# EAGLE schematic prototypeV2.1 (EAGLE 9.4.2)
DESIGNER: Juan J. Rojas; INSTITUTION: Kyushu Institute of Technology; PROJECT_NAME: BDC_Prototype; VERSION: 1.1
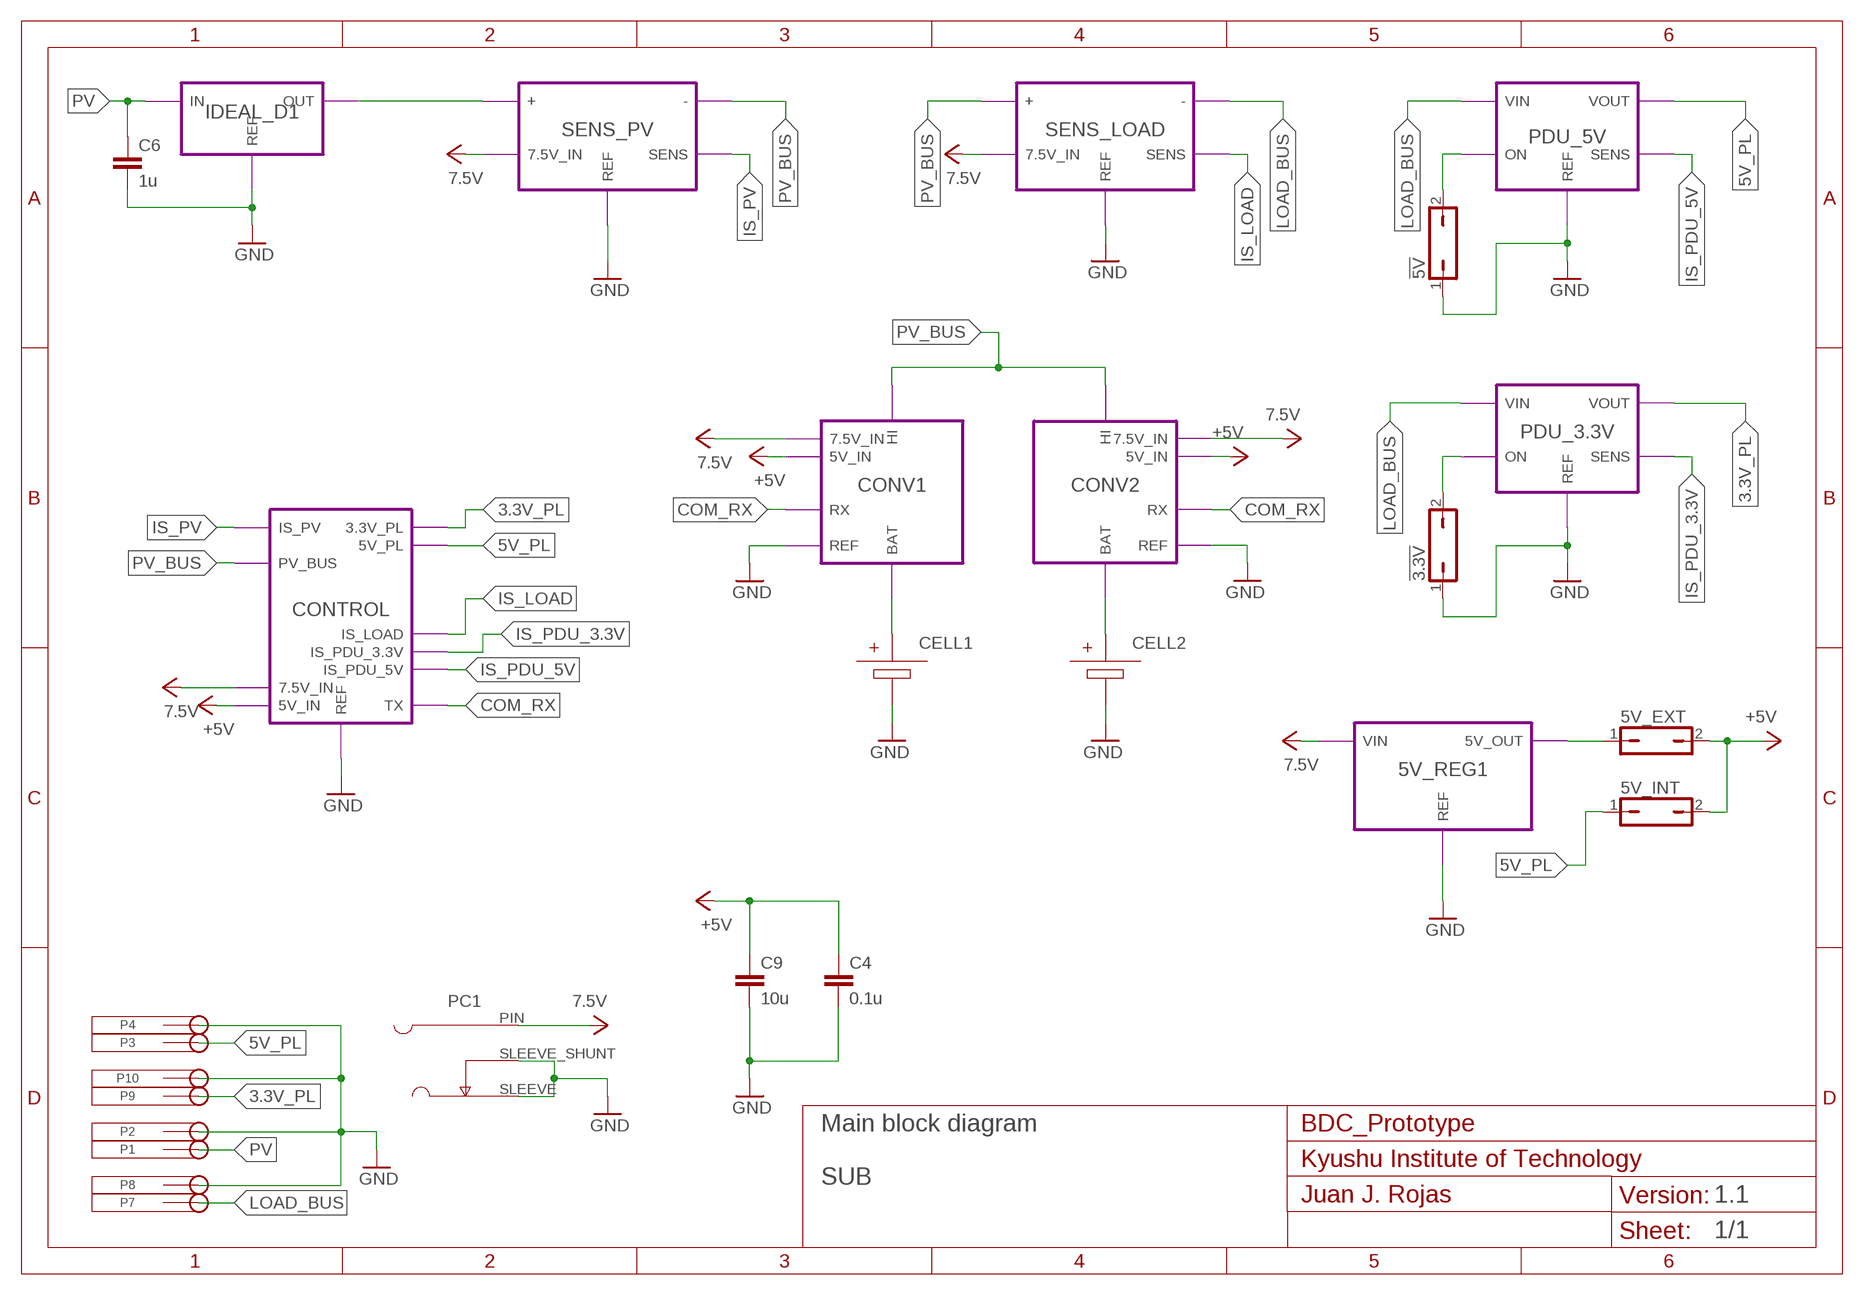
[diagram p0: schematic, sheet 1]
FRAME1 (A4L-JUANJO): SUBTITLE: SUB; TITLE: Main block diagram

## Parts
5V_EXT  J2PSINGLE  [J2P]
5V_INT  J2PSINGLE  [J2P]
!3.3V  J2PSINGLE  [J2P]
!5V  J2PSINGLE  [J2P]
C4  0.1u  NONPOL_CAP-0603  [C0603]
C6  1u  NONPOL_CAP-0603  [C0603]
C9  10u  NONPOL_CAP-0603  [C0603]
CELL1  CELL18650_HOLDER  [18650_HOLDER]
CELL2  CELL18650_HOLDER  [18650_HOLDER]
P1  TJ-563  [TJ-563]
P2  TJ-563  [TJ-563]
P3  TJ-563  [TJ-563]
P4  TJ-563  [TJ-563]
P7  TJ-563  [TJ-563]
P8  TJ-563  [TJ-563]
P9  TJ-563  [TJ-563]
P10  TJ-563  [TJ-563]
PC1  722RA  [722RA]

## Module instances
CONV1 = BIDIRECTIONAL_CONVERTER (part numbers offset by 100)
CONV2 = BIDIRECTIONAL_CONVERTER (part numbers offset by 200)
SENS_PV = BI_CURR_MEAS (part numbers offset by 500)
SENS_LOAD = BI_CURR_MEAS (part numbers offset by 600)
5V_REG1 = 5V_REGULATOR (part numbers offset by 800)
PDU_5V = POWER_DISTRIBUTION_UNIT_5V (part numbers offset by 900)
IDEAL_D1 = IDEAL_DIODE (part numbers offset by 1100)
PDU_3.3V = POWER_DISTRIBUTION_UNIT_3.3V (part numbers offset by 1200)
CONTROL = CONTROLLER (part numbers offset by 300)

## Nets
3.3V_PL: P9.P(PIN) ; port PDU_3.3V.VOUT CONTROL.3.3V_PL
5V_ON: !5V.2 ; port PDU_5V.ON
5V_PL: 5V_INT.1 P3.P(PIN) ; port PDU_5V.VOUT CONTROL.5V_PL
7.5V: PC1.PIN ; port SENS_PV.7.5V_IN SENS_LOAD.7.5V_IN 5V_REG1.VIN CONV1.7.5V_IN CONV2.7.5V_IN CONTROL.7.5V_IN
12V_ON: !3.3V.2 ; port PDU_3.3V.ON
+5V: 5V_EXT.2 5V_INT.2 C4.1 C9.1 ; port CONV1.5V_IN CONV2.5V_IN CONTROL.5V_IN
COM_RX: port CONV1.RX CONV2.RX CONTROL.TX
GND: !3.3V.1 !5V.1 C4.2 C6.2 C9.2 CELL1.BB1.N(-) CELL2.BB1.N(-) P2.P(PIN) P4.P(PIN) P8.P(PIN) P10.P(PIN) PC1.SLEEVE PC1.SLEEVE_SHUNT ; port CONV1.REF CONV2.REF SENS_PV.REF SENS_LOAD.REF PDU_5V.REF IDEAL_D1.REF PDU_3.3V.REF 5V_REG1.REF CONTROL.REF
IS_LOAD: port SENS_LOAD.SENS CONTROL.IS_LOAD
IS_PDU_3.3V: port CONTROL.IS_PDU_3.3V PDU_3.3V.SENS
IS_PDU_5V: port CONTROL.IS_PDU_5V PDU_5V.SENS
IS_PV: port SENS_PV.SENS CONTROL.IS_PV
LOAD_BUS: P7.P(PIN) ; port SENS_LOAD.- PDU_5V.VIN PDU_3.3V.VIN
N$1: CELL1.BB1.P(+) ; port CONV1.BAT
N$4: CELL2.BB1.P(+) ; port CONV2.BAT
N$5: 5V_EXT.1 ; port 5V_REG1.5V_OUT
N$6: port SENS_PV.+ IDEAL_D1.OUT
PV: C6.1 P1.P(PIN) ; port IDEAL_D1.IN
PV_BUS: port SENS_PV.- CONV1.HI CONV2.HI SENS_LOAD.+ CONTROL.PV_BUS

## Library data of the parts
5V_EXT 5V_INT !3.3V !5V = Interfaces:J2P: JUMPER
C4 C6 C9 = Pasives:NONPOL_CAP
CELL1 CELL2 = Sources:CELL
P1-P4 P7-P10 = Interfaces:TJ-563
PC1 = Interfaces:722RA

## Module BIDIRECTIONAL_CONVERTER
Ports: REF(pwr) HI(io) 7.5V_IN(pwr) 5V_IN(pwr) RX(io) BAT(io)
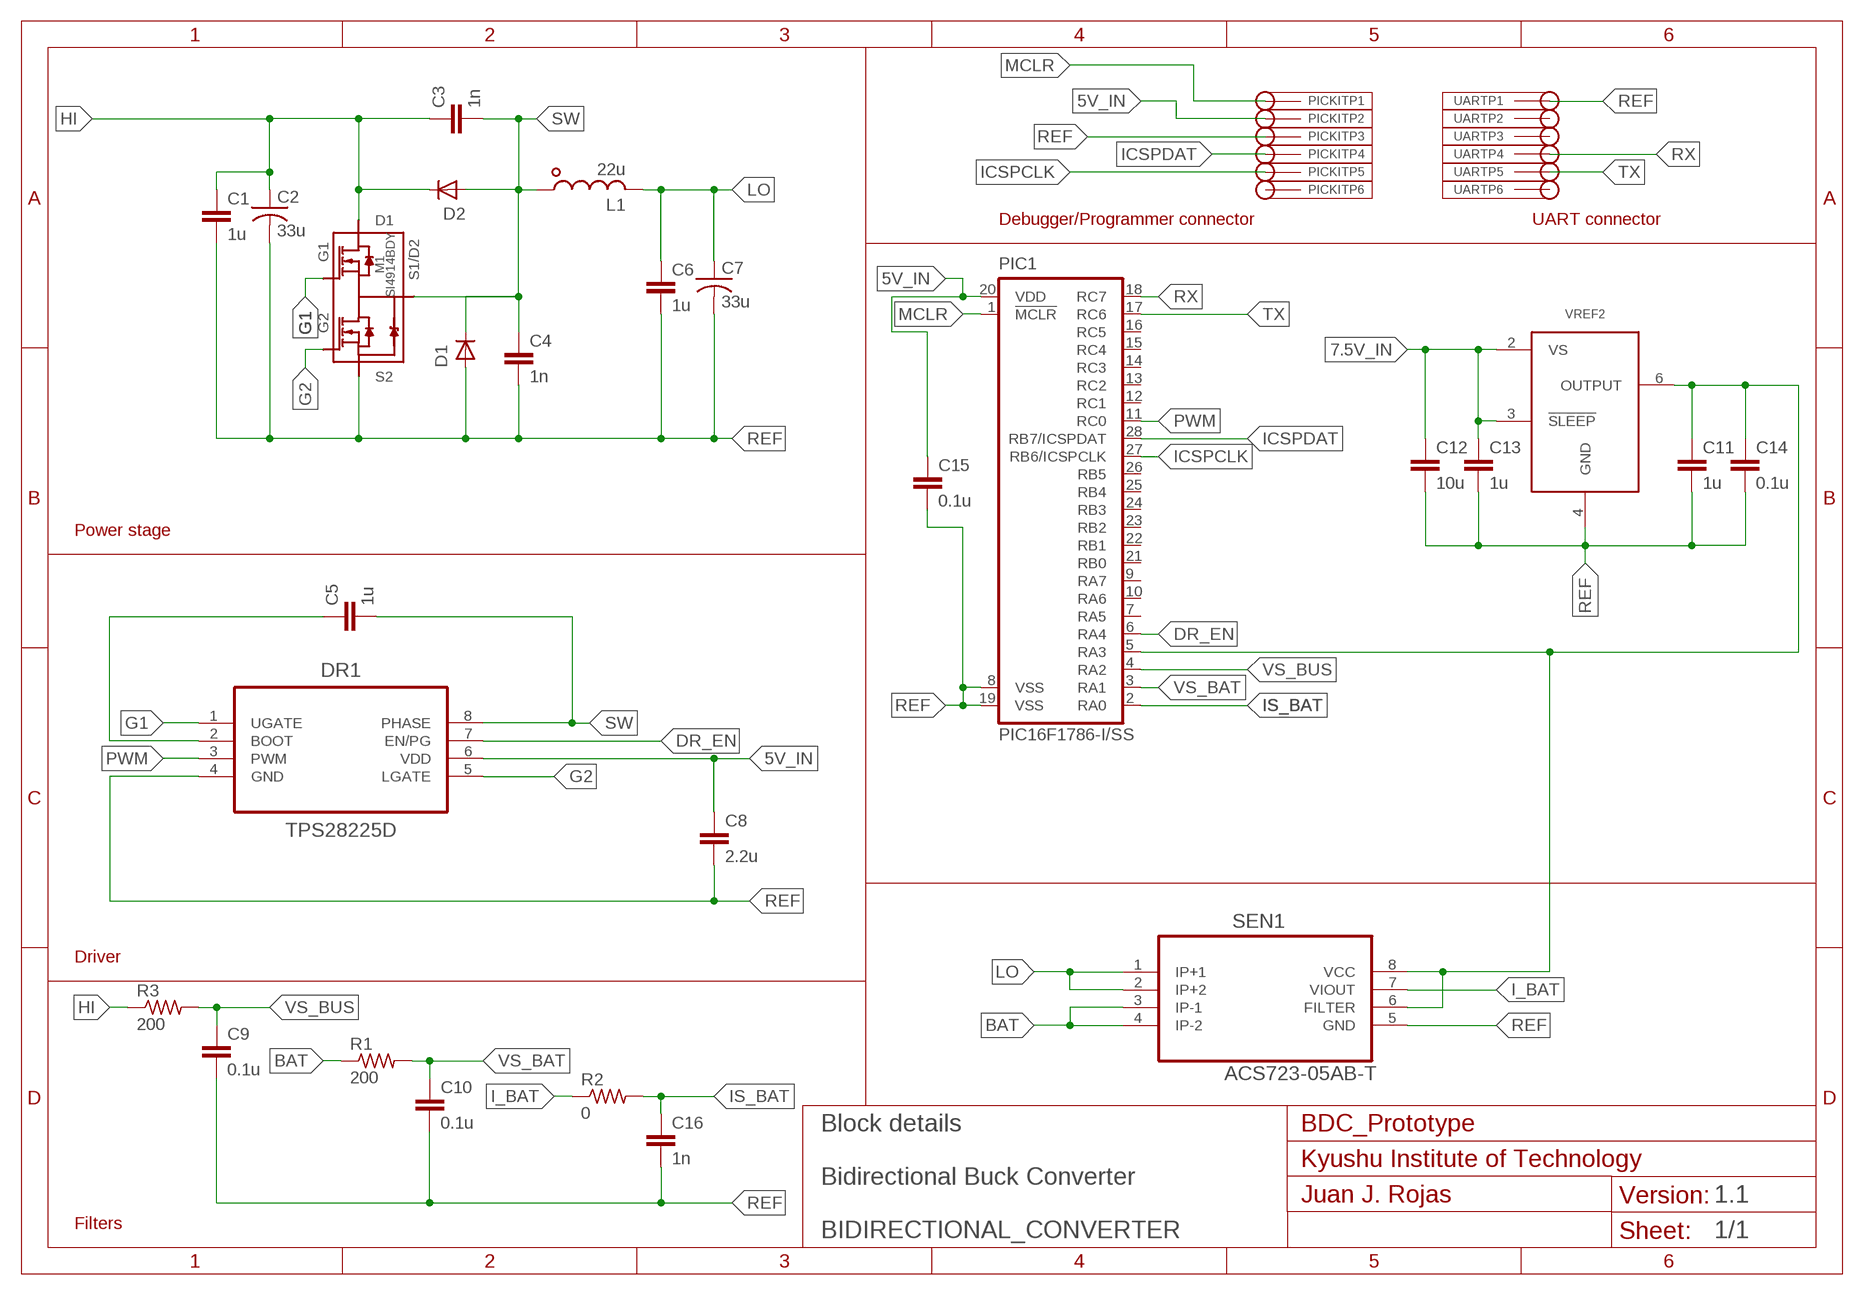
[diagram p1: schematic, module BIDIRECTIONAL_CONVERTER, sheet 1]
FRAME1 (A4L-JUANJO): SUBTITLE: Bidirectional Buck Converter; TITLE: Block details

### Parts
C1  1u  NONPOL_CAP-0603  [C0603]
C2  33u  POL_CAP-7343  [C7343]
C3  1n  NONPOL_CAP-0603  [C0603]
C4  1n  NONPOL_CAP-0603  [C0603]
C5  1u  NONPOL_CAP-0603  [C0603]
C6  1u  NONPOL_CAP-0603  [C0603]
C7  33u  POL_CAP-7343  [C7343]
C8  2.2u  NONPOL_CAP-0603  [C0603]
C9  0.1u  NONPOL_CAP-0603  [C0603]
C10  0.1u  NONPOL_CAP-0603  [C0603]
C11  1u  NONPOL_CAP-0603  [C0603]
C12  10u  NONPOL_CAP-0603  [C0603]
C13  1u  NONPOL_CAP-0603  [C0603]
C14  0.1u  NONPOL_CAP-0603  [C0603]
C15  0.1u  NONPOL_CAP-0603  [C0603]
C16  1n  NONPOL_CAP-0603  [C0603]
D1  DIODE-SMB  [SMB]
D2  DIODE-SMB  [SMB]
DR1  TPS28225D  [SOIC-8]
L1  22u  INDUCTOR-CLF12555  [CLF12555]
M1  SI4914BDY  [SOIC-8]
PIC1  PIC16F1786-I/SS  [SSOP28]
PICKIT  MA06-1  [MA06-1]
R1  200  RESISTOR-0603  [R0603]
R2  0  RESISTOR-0603  [R0603]
R3  200  RESISTOR-0603  [R0603]
SEN1  ACS723-05AB-T  [SOIC-8]
UART  MA06-1  [MA06-1]
VREF2  REF195GSZ  [SOIC-8]

### Nets
5V_IN: C8.1 C15.1 DR1.6(VDD) PIC1.20(VDD) PICKIT.2
5V_REF: C11.1 C14.1 PIC1.5(RA3) SEN1.6(FILTER) SEN1.8(VCC) VREF2.6(OUTPUT)
7.5V_IN: C12.1 C13.1 VREF2.2(VS) VREF2.3(!SLEEP!)
BAT: R1.1 SEN1.3(IP-1) SEN1.4(IP-2)
DR_EN: DR1.7(EN/PG) PIC1.6(RA4)
G1: DR1.1(UGATE) M1.8(G1)
G2: DR1.5(LGATE) M1.3(G2)
HI: C1.1 C2.+ C3.1 D2.C M1.1(D1) M1.2(D1) R3.1
I_BAT: R2.1 SEN1.7(VIOUT)
ICSPCLK: PIC1.27(RB6/ICSPCLK) PICKIT.5
ICSPDAT: PIC1.28(RB7/ICSPDAT) PICKIT.4
IS_BAT: C16.1 PIC1.2(RA0) R2.2
LO: C6.1 C7.+ L1.2 SEN1.1(IP+1) SEN1.2(IP+2)
MCLR: PIC1.1(!MCLR) PICKIT.1
N$2: C5.1 DR1.2(BOOT)
PWM: DR1.3(PWM) PIC1.11(RC0)
REF: C1.2 C2.- C4.2 C6.2 C7.- C8.2 C9.2 C10.2 C11.2 C12.2 C13.2 C14.2 C15.2 C16.2 D1.A DR1.4(GND) M1.4(S2) PIC1.8(VSS) PIC1.19(VSS) PICKIT.3 SEN1.5(GND) UART.1 VREF2.4(GND)
RX: PIC1.18(RC7) UART.4
SW: C3.2 C4.1 C5.2 D1.C D2.A DR1.8(PHASE) L1.1 M1.5(S1/D2) M1.6(S1/D2) M1.7(S1/D2)
TX: PIC1.17(RC6) UART.5
VS_BAT: C10.1 PIC1.3(RA1) R1.2
VS_BUS: C9.1 PIC1.4(RA2) R3.2
Unconnected: PIC1.7(RA5) PIC1.9(RA7) PIC1.10(RA6) PIC1.12(RC1) PIC1.13(RC2) PIC1.14(RC3) PIC1.15(RC4) PIC1.16(RC5) PIC1.21(RB0) PIC1.22(RB1) PIC1.23(RB2) PIC1.24(RB3) PIC1.25(RB4) PIC1.26(RB5) PICKIT.6 UART.2 UART.3 UART.6

### Notes on the sheet
- Debugger/Programmer connector | UART connector
- Power stage
- Driver
- Filters

### Library data of the parts
C1 C3-C6 C8-C16 = Pasives:NONPOL_CAP
C2 C7 = Pasives:POL_CAP
D1 D2 = Pasives:DIODE
DR1 = ICs:TPS28225D
L1 = Pasives:INDUCTOR: SMD Power Inductor
M1 = ICs:SI4914BDY
PIC1 = ICs:PIC16F1786
PICKIT UART = Interfaces:MA06-1: PIN HEADER; OC_FARNELL: unknown; OC_NEWARK: unknown
R1-R3 = Pasives:RESISTOR: RESISTOR
SEN1 = ICs:ACS723-05AB-T: Hall Effect-Based Linear Current Sensor IC - 5A
VREF2 = ICs:REF195GSZ

## Module DRIVER_MODULE
Ports: G1(io) SW(io) G2(io) REF(io) VDD(io) PWM(io)
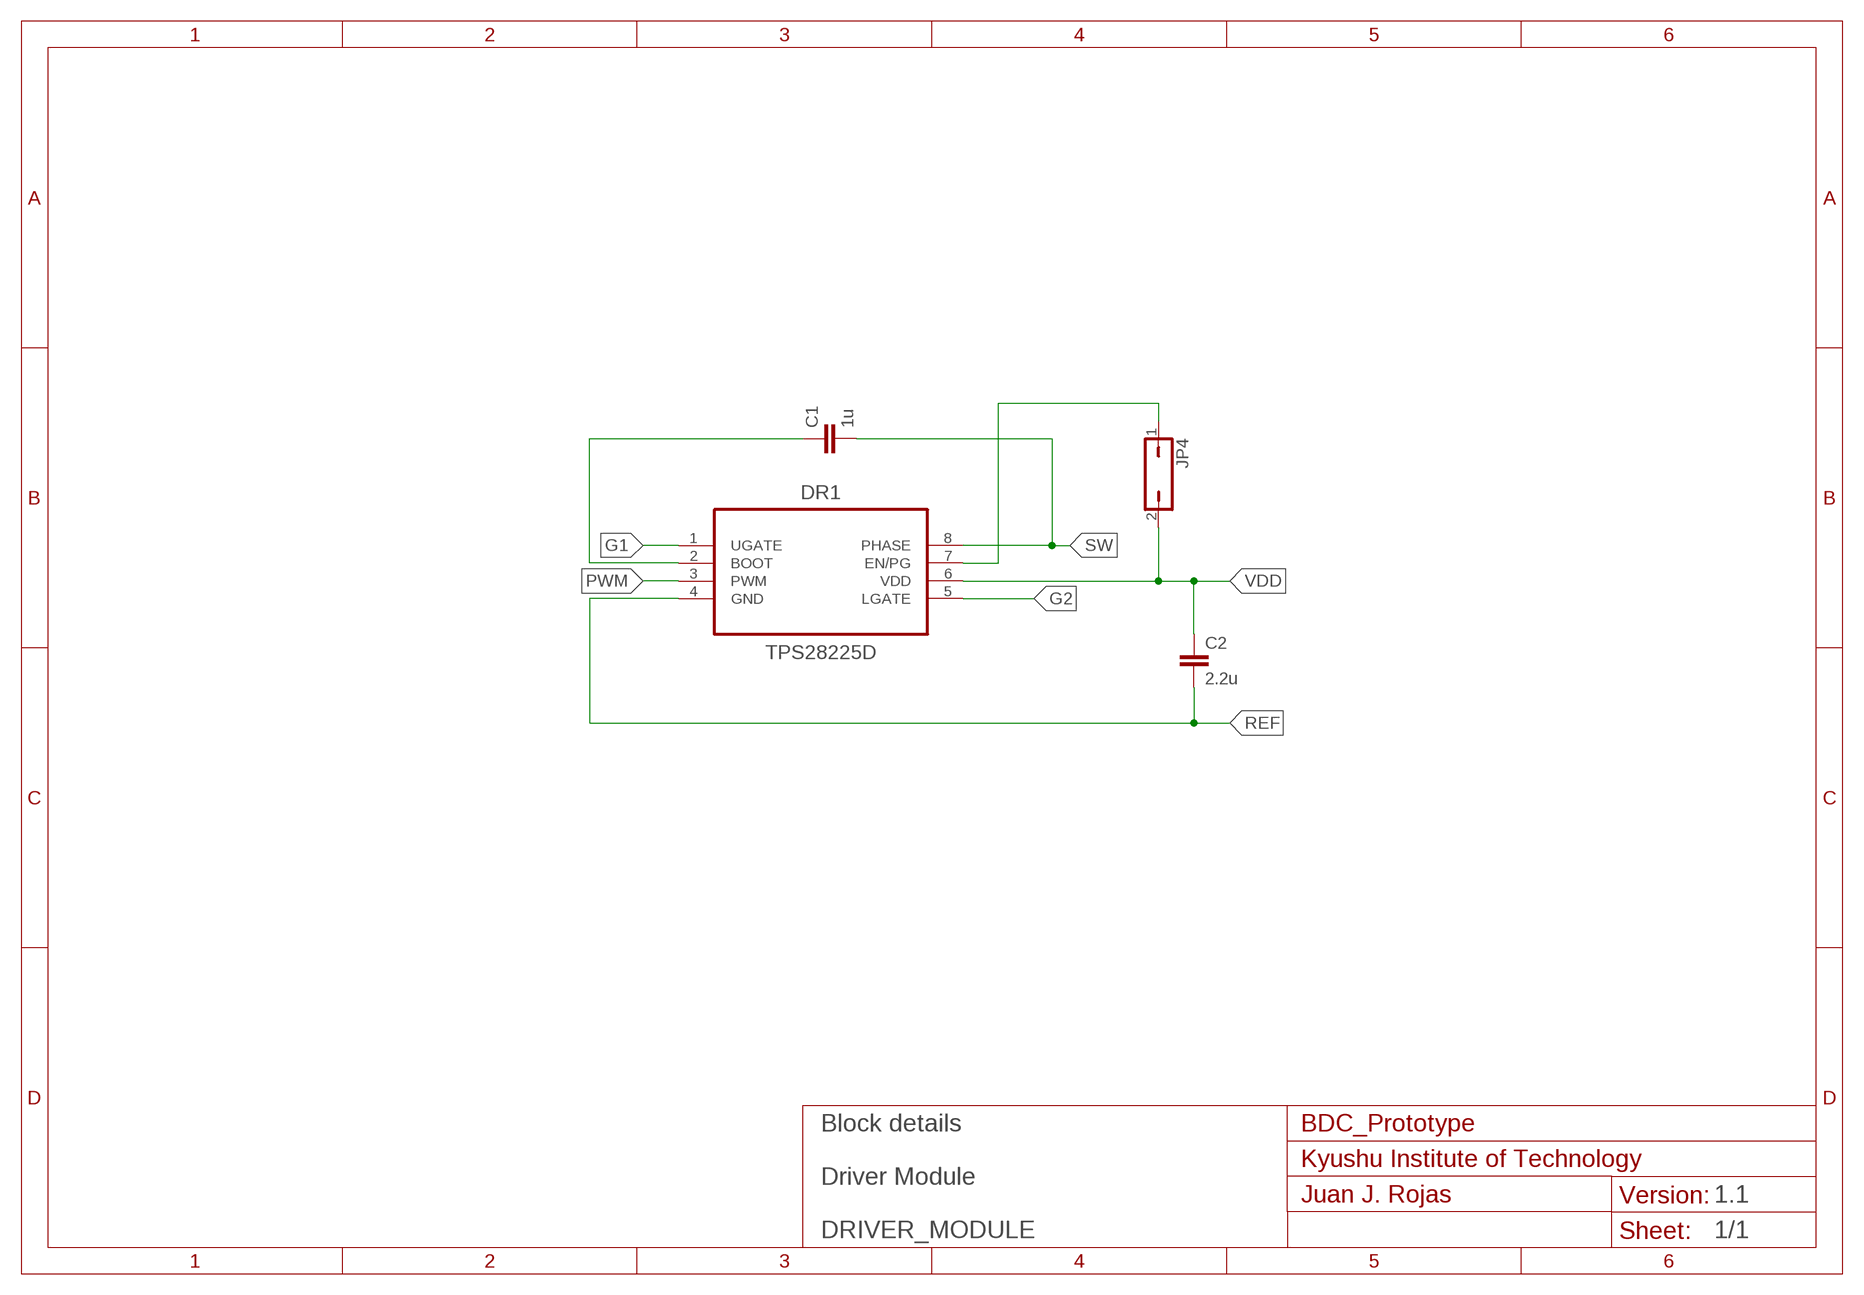
[diagram p2: schematic, module DRIVER_MODULE, sheet 1]
FRAME1 (A4L-JUANJO): SUBTITLE: Driver Module; TITLE: Block details

### Parts
C1  1u  NONPOL_CAP-0603  [C0603]
C2  2.2u  NONPOL_CAP-0603  [C0603]
DR1  TPS28225D  [SOIC-8]
JP4  J2PSINGLE  [J2P]

### Nets
G1: DR1.1(UGATE)
G2: DR1.5(LGATE)
N$1: DR1.7(EN/PG) JP4.1
N$2: C1.1 DR1.2(BOOT)
PWM: DR1.3(PWM)
REF: C2.2 DR1.4(GND)
SW: C1.2 DR1.8(PHASE)
VDD: C2.1 DR1.6(VDD) JP4.2

### Library data of the parts
C1 C2 = Pasives:NONPOL_CAP
DR1 = ICs:TPS28225D
JP4 = Interfaces:J2P: JUMPER

## Module BI_CURR_MEAS
Ports: REF(pwr) +(io) -(io) SENS(io) 7.5V_IN(pwr)
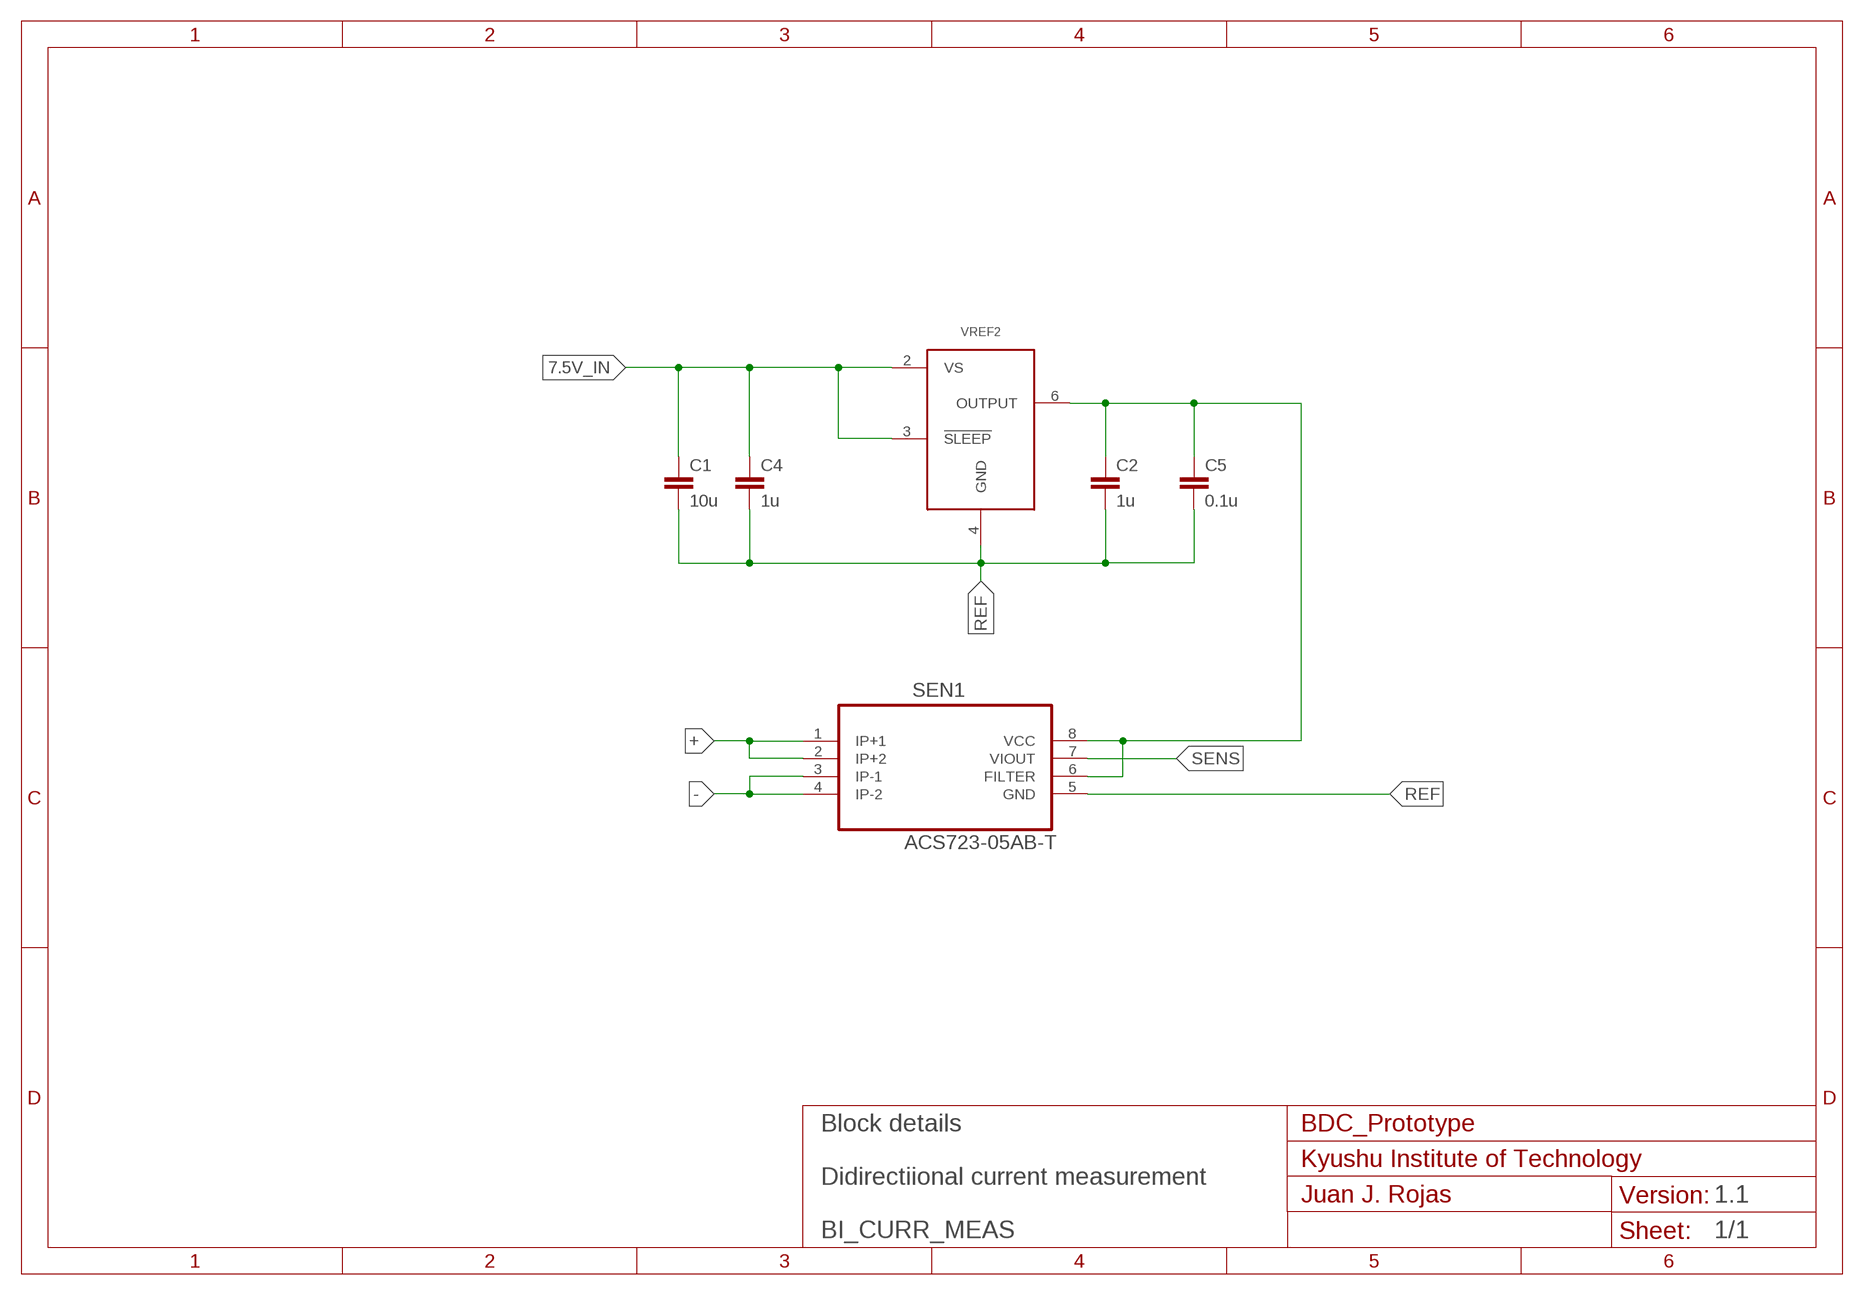
[diagram p3: schematic, module BI_CURR_MEAS, sheet 1]
FRAME2 (A4L-JUANJO): SUBTITLE: Didirectiional current measurement; TITLE: Block details

### Parts
C1  10u  NONPOL_CAP-0603  [C0603]
C2  1u  NONPOL_CAP-0603  [C0603]
C4  1u  NONPOL_CAP-0603  [C0603]
C5  0.1u  NONPOL_CAP-0603  [C0603]
SEN1  ACS723-05AB-T  [SOIC-8]
VREF2  REF195GSZ  [SOIC-8]

### Nets
5V_REF: C2.1 C5.1 SEN1.6(FILTER) SEN1.8(VCC) VREF2.6(OUTPUT)
7.5V_IN: C1.1 C4.1 VREF2.2(VS) VREF2.3(!SLEEP!)
+: SEN1.1(IP+1) SEN1.2(IP+2)
-: SEN1.3(IP-1) SEN1.4(IP-2)
REF: C1.2 C2.2 C4.2 C5.2 SEN1.5(GND) VREF2.4(GND)
SENS: SEN1.7(VIOUT)

### Library data of the parts
C1 C2 C4 C5 = Pasives:NONPOL_CAP
SEN1 = ICs:ACS723-05AB-T: Hall Effect-Based Linear Current Sensor IC - 5A
VREF2 = ICs:REF195GSZ

## Module 5V_REGULATOR
Ports: 5V_OUT(io) VIN(pwr) REF(pwr)
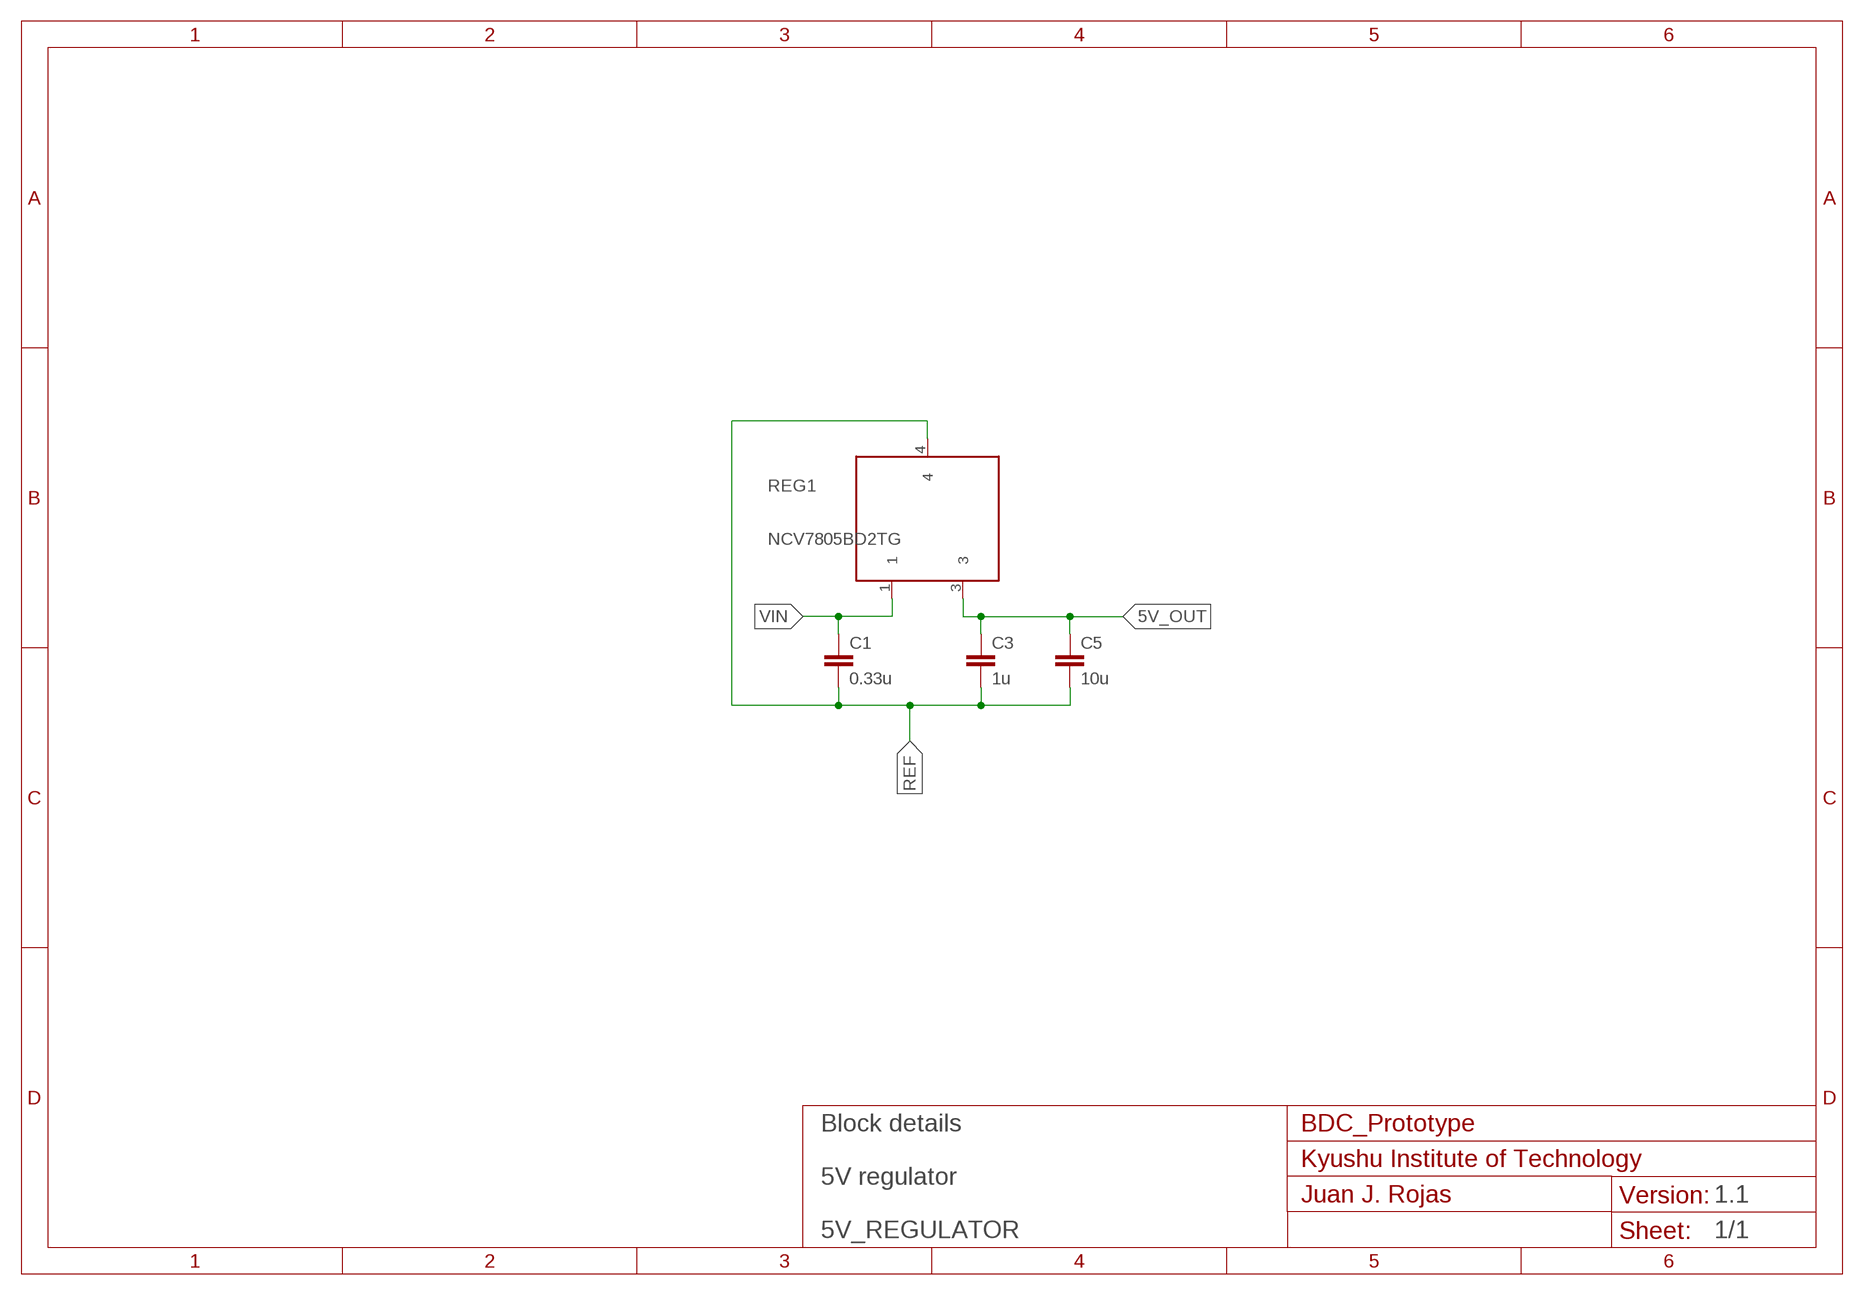
[diagram p4: schematic, module 5V_REGULATOR, sheet 1]
FRAME2 (A4L-JUANJO): SUBTITLE: 5V regulator; TITLE: Block details

### Parts
C1  0.33u  NONPOL_CAP-0603  [C0603]
C3  1u  NONPOL_CAP-0603  [C0603]
C5  10u  NONPOL_CAP-0603  [C0603]
REG1  NCV7805BD2TG  [D2PAK-3]

### Nets
5V_OUT: C3.1 C5.1 REG1.3
REF: C1.2 C3.2 C5.2 REG1.4
VIN: C1.1 REG1.1

### Library data of the parts
C1 C3 C5 = Pasives:NONPOL_CAP
REG1 = ICs:NCV7805BD2TG

## Module POWER_DISTRIBUTION_UNIT_5V
Ports: VIN(io) VOUT(io) SENS(io) ON(io) REF(pwr)
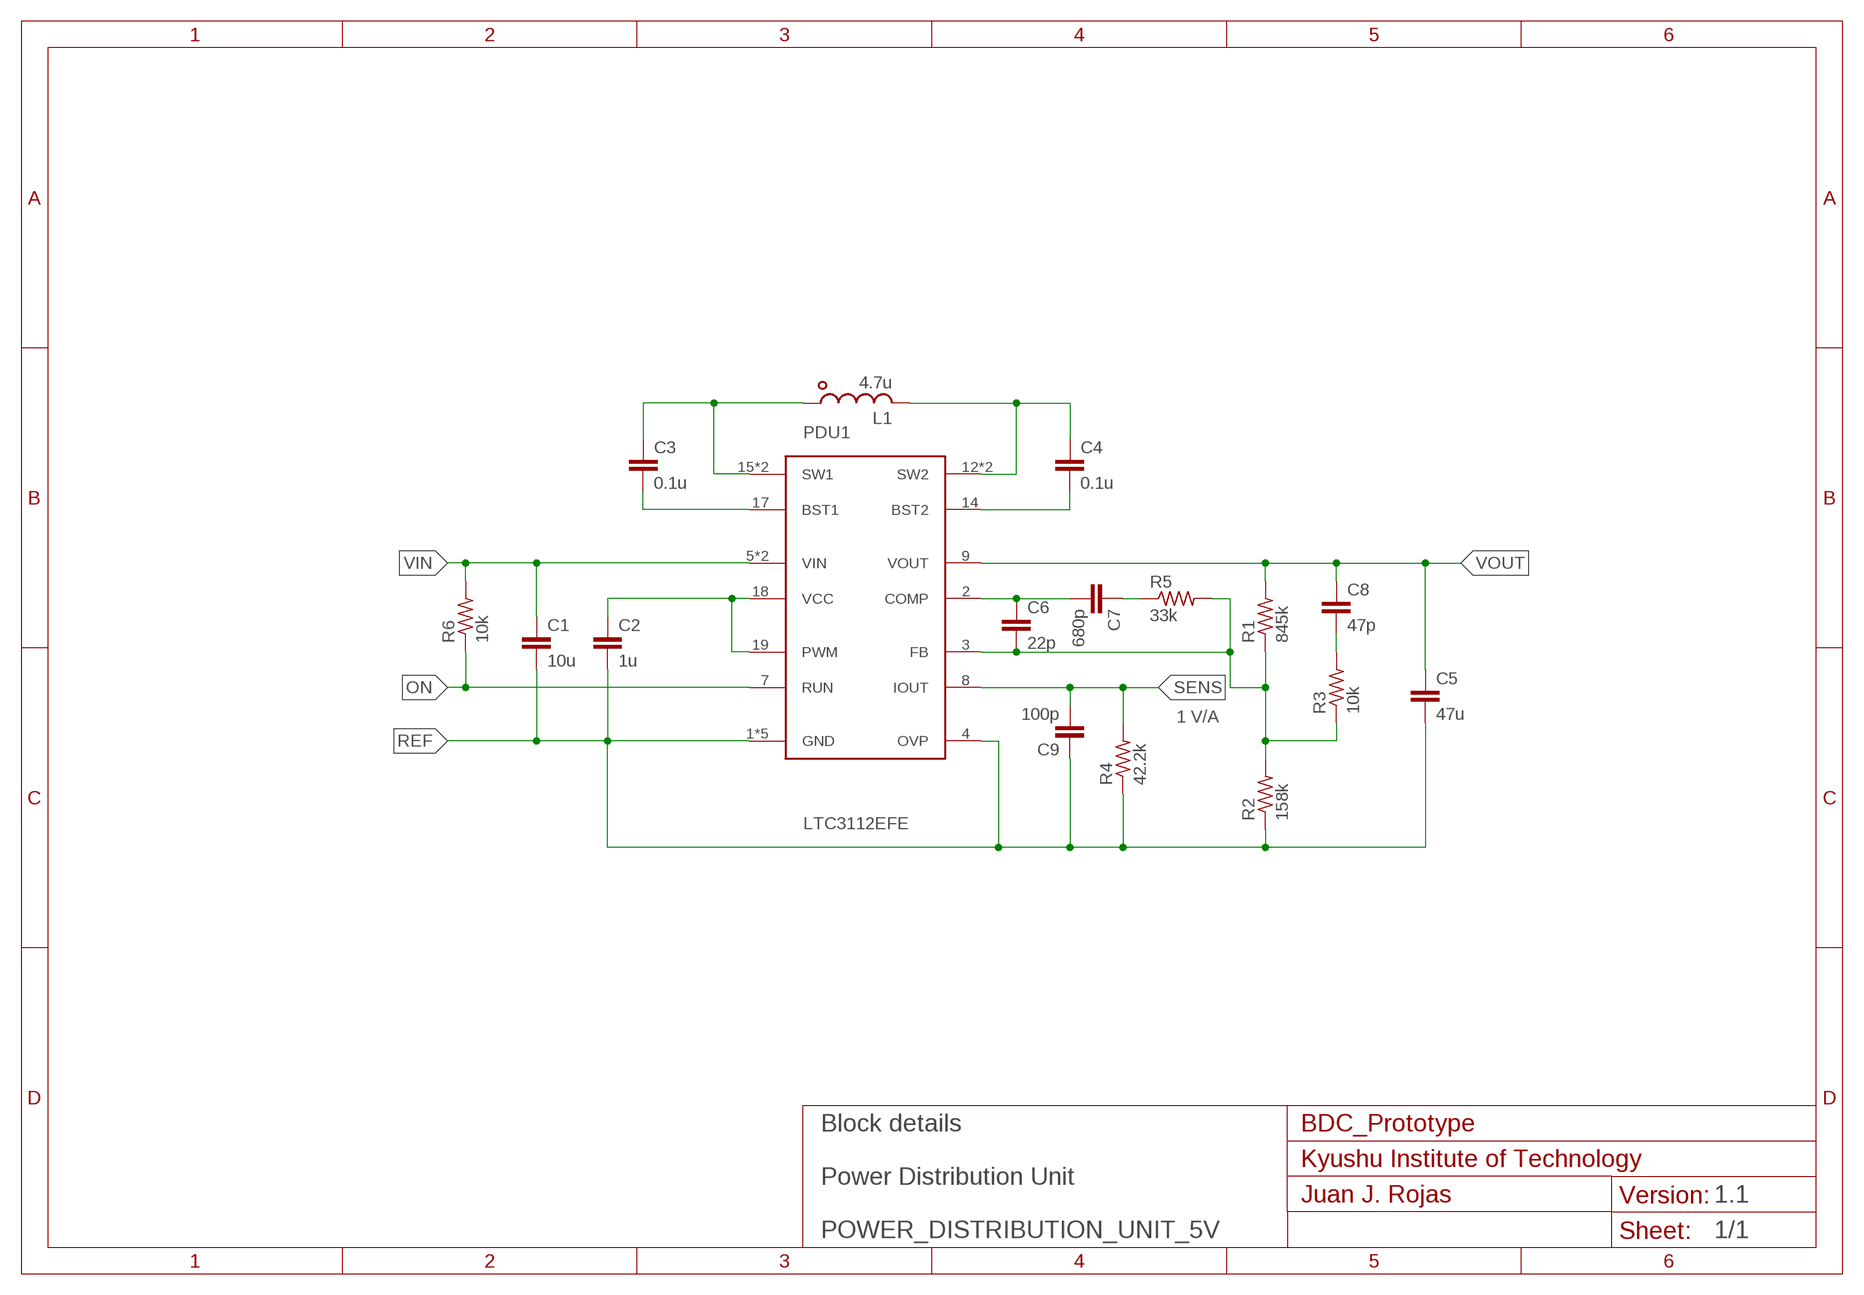
[diagram p5: schematic, module POWER_DISTRIBUTION_UNIT_5V, sheet 1]
FRAME2 (A4L-JUANJO): SUBTITLE: Power Distribution Unit; TITLE: Block details

### Parts
C1  10u  NONPOL_CAP-0603  [C0603]
C2  1u  NONPOL_CAP-0603  [C0603]
C3  0.1u  NONPOL_CAP-0603  [C0603]
C4  0.1u  NONPOL_CAP-0603  [C0603]
C5  47u  NONPOL_CAP-1210  [C1210]
C6  22p  NONPOL_CAP-0603  [C0603]
C7  680p  NONPOL_CAP-0603  [C0603]
C8  47p  NONPOL_CAP-0603  [C0603]
C9  100p  NONPOL_CAP-0603  [C0603]
L1  4.7u  INDUCTOR-SPM4020T  [SPM4020T]
PDU1  LTC3112EFE  [TSSOP20CA]
R1  845k  RESISTOR-0603  [R0603]
R2  158k  RESISTOR-0603  [R0603]
R3  10k  RESISTOR-0603  [R0603]
R4  42.2k  RESISTOR-0603  [R0603]
R5  33k  RESISTOR-0603  [R0603]
R6  10k  RESISTOR-0603  [R0603]

### Nets
N$1: C3.2 PDU1.17(BST1)
N$2: C2.1 PDU1.18(VCC) PDU1.19(PWM)
N$3: C4.2 PDU1.14(BST2)
N$4: C3.1 L1.1 PDU1.15(SW1) PDU1.16(SW1)
N$5: C7.1 R5.1
N$6: C6.1 C7.2 PDU1.2(COMP)
N$7: C4.1 L1.2 PDU1.12(SW2) PDU1.13(SW2)
N$8: C8.2 R3.2
N$9: C6.2 PDU1.3(FB) R1.1 R2.2 R3.1 R5.2
ON: PDU1.7(RUN) R6.1
REF: C1.2 C2.2 C5.2 C9.1 PDU1.1(GND) PDU1.4(OVP) PDU1.10(GND) PDU1.11(GND) PDU1.20(GND) PDU1.21(GND) R2.1 R4.1
SENS: C9.2 PDU1.8(IOUT) R4.2
VIN: C1.1 PDU1.5(VIN) PDU1.6(VIN) R6.2
VOUT: C5.1 C8.1 PDU1.9(VOUT) R1.2

### Notes on the sheet
- 1 V/A

### Library data of the parts
C1-C9 = Pasives:NONPOL_CAP
L1 = Pasives:INDUCTOR: SMD Power Inductor
PDU1 = ICs:LTC3112
R1-R6 = Pasives:RESISTOR: RESISTOR

## Module IDEAL_DIODE
Ports: IN(io) OUT(io) REF(pwr)
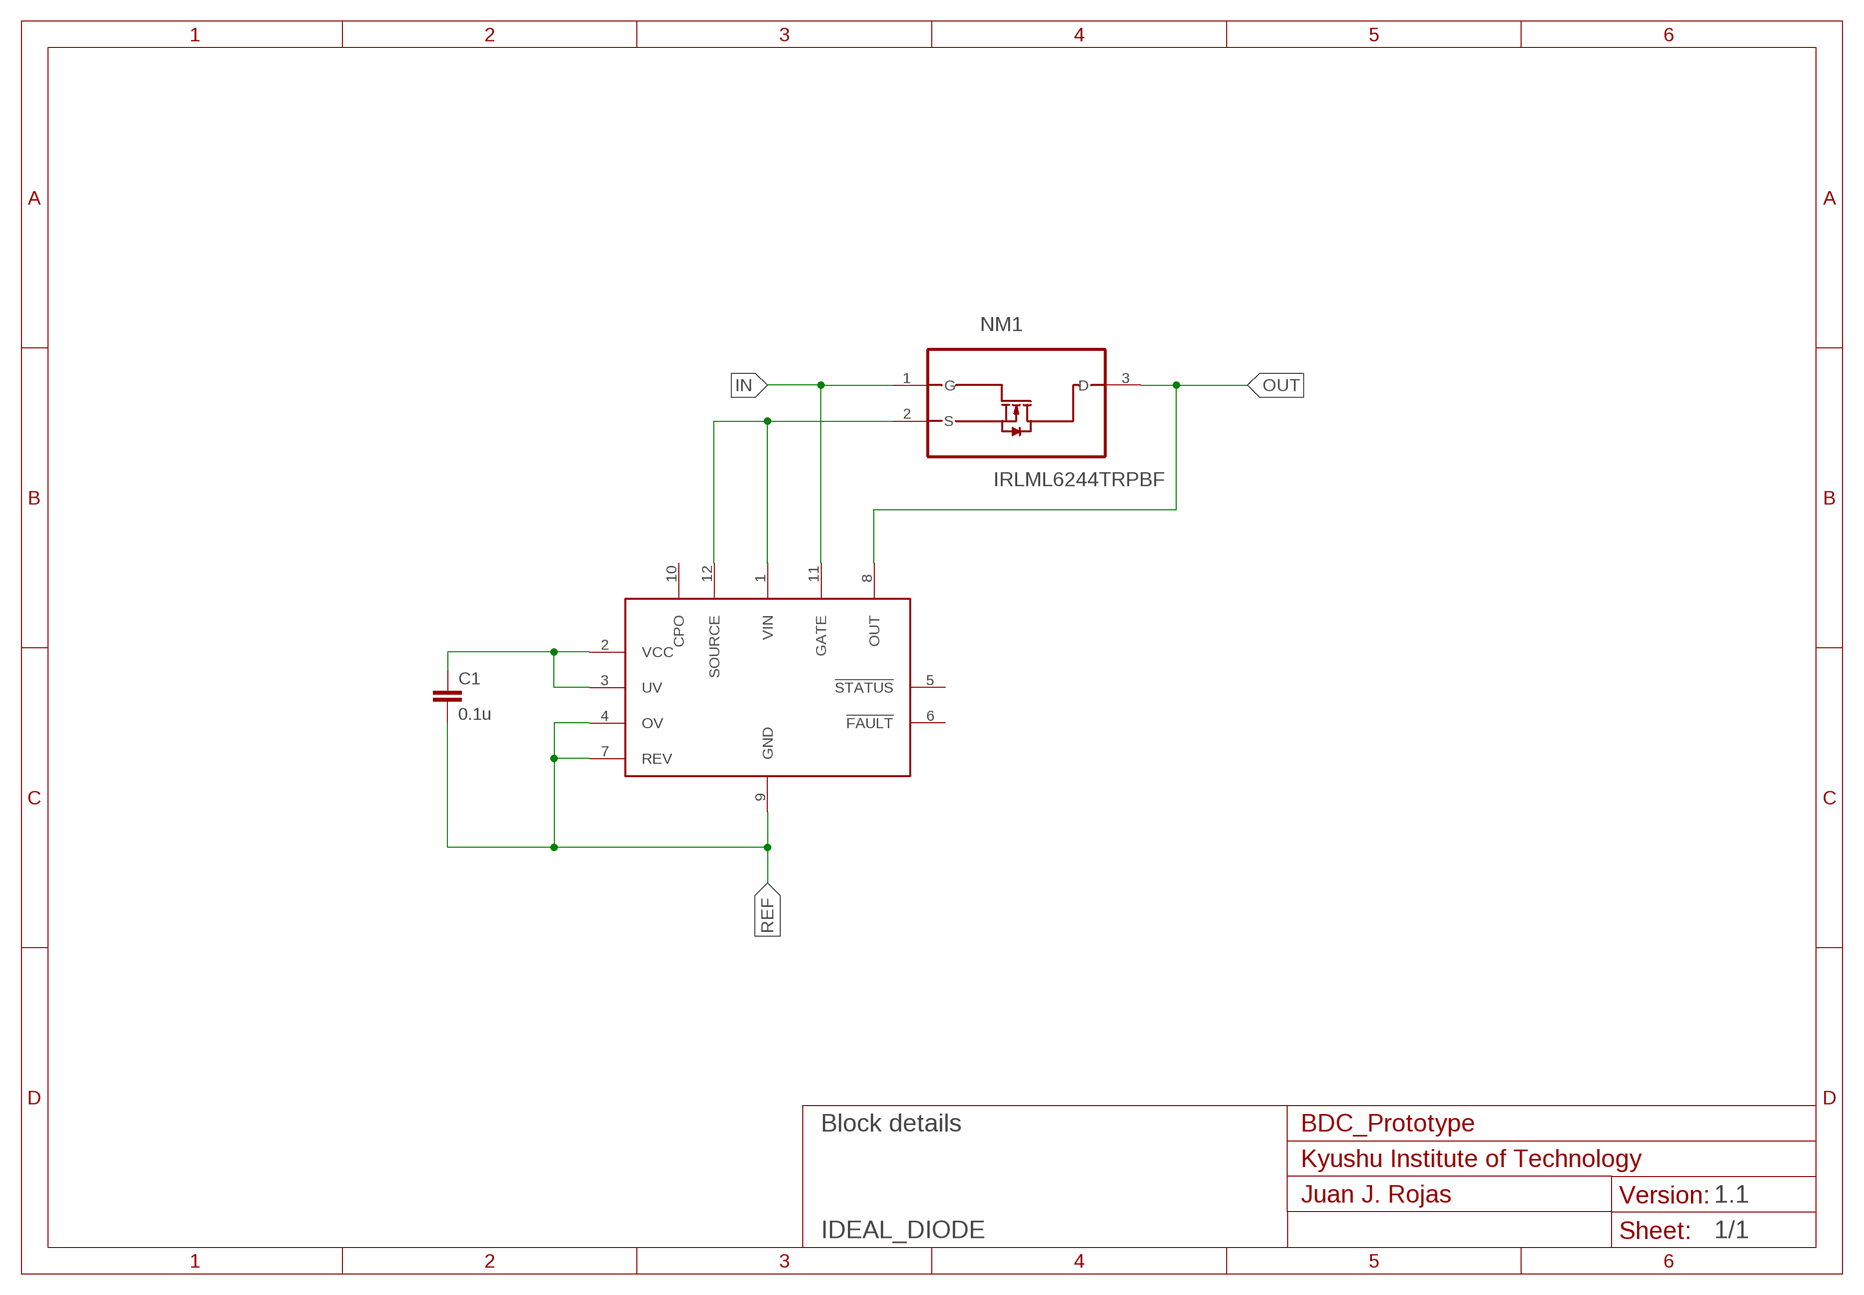
[diagram p6: schematic, module IDEAL_DIODE, sheet 1]
FRAME2 (A4L-JUANJO): TITLE: Block details

### Parts
C1  0.1u  NONPOL_CAP-0603  [C0603]
IDD1  LTC4352CMS  [MSOP12]
NM1  IRLML6244TRPBF  [SOT-23]

### Nets
IN: IDD1.11(GATE) NM1.1(G)
N$1: IDD1.1(VIN) IDD1.12(SOURCE) NM1.2(S)
N$4: C1.1 IDD1.2(VCC) IDD1.3(UV)
OUT: IDD1.8(OUT) NM1.3(D)
REF: C1.2 IDD1.4(OV) IDD1.7(REV) IDD1.9(GND)
Unconnected: IDD1.5(!STATUS) IDD1.6(!FAULT) IDD1.10(CPO)

### Library data of the parts
C1 = Pasives:NONPOL_CAP
IDD1 = ICs:LTC4352
NM1 = ICs:IRLML6244TRPBF: N-channel MOSFET, 6.3 A, 20 V HEXFET; RS_SN: 737-7228

## Module POWER_DISTRIBUTION_UNIT_3.3V
Ports: VIN(io) VOUT(io) ON(io) SENS(io) REF(io)
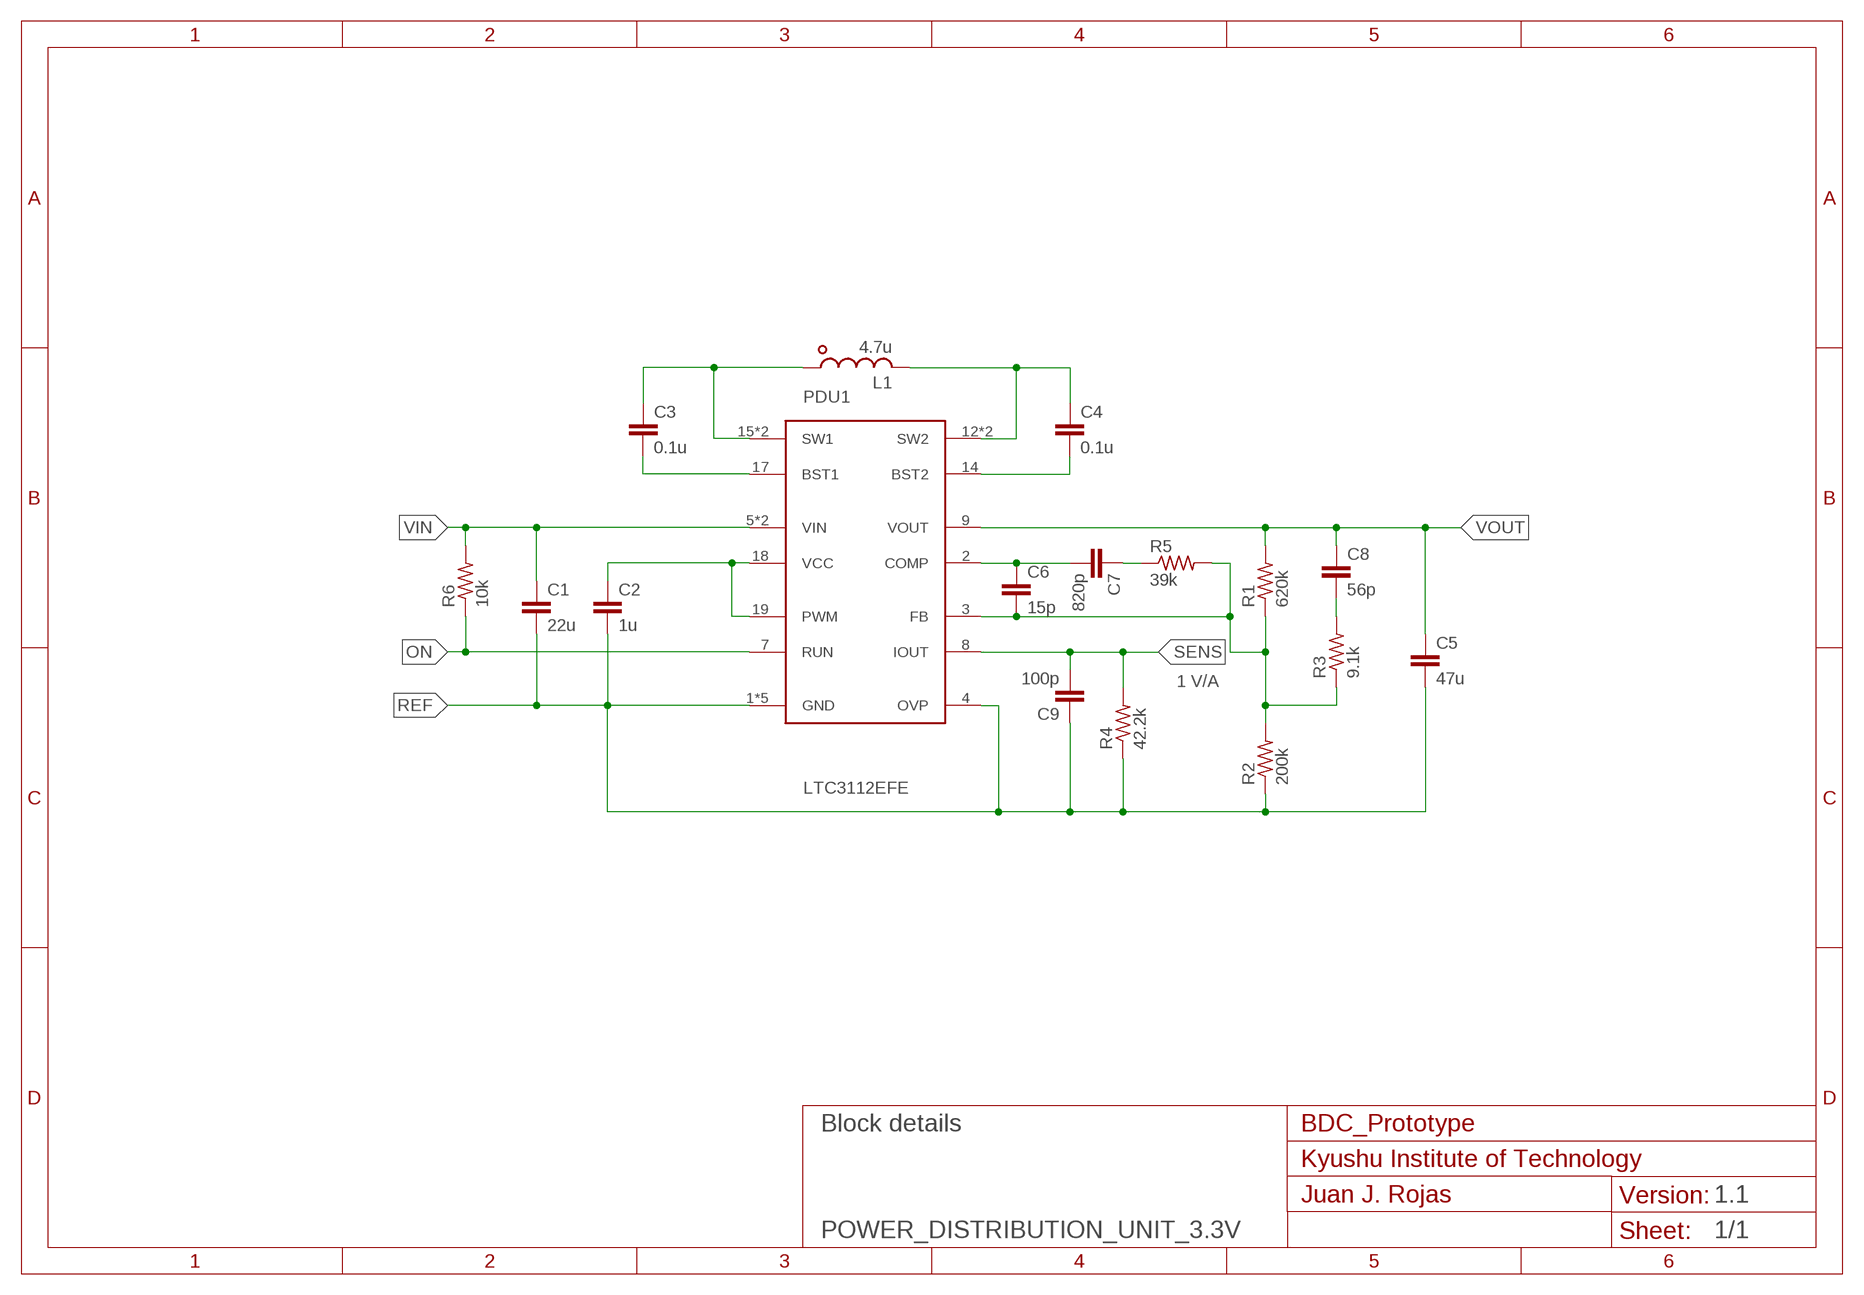
[diagram p7: schematic, module POWER_DISTRIBUTION_UNIT_3.3V, sheet 1]
FRAME2 (A4L-JUANJO): TITLE: Block details

### Parts
C1  22u  NONPOL_CAP-0603  [C0603]
C2  1u  NONPOL_CAP-0603  [C0603]
C3  0.1u  NONPOL_CAP-0603  [C0603]
C4  0.1u  NONPOL_CAP-0603  [C0603]
C5  47u  NONPOL_CAP-1210  [C1210]
C6  15p  NONPOL_CAP-0603  [C0603]
C7  820p  NONPOL_CAP-0603  [C0603]
C8  56p  NONPOL_CAP-0603  [C0603]
C9  100p  NONPOL_CAP-0603  [C0603]
L1  4.7u  INDUCTOR-SPM4020T  [SPM4020T]
PDU1  LTC3112EFE  [TSSOP20CA]
R1  620k  RESISTOR-0603  [R0603]
R2  200k  RESISTOR-0603  [R0603]
R3  9.1k  RESISTOR-0603  [R0603]
R4  42.2k  RESISTOR-0603  [R0603]
R5  39k  RESISTOR-0603  [R0603]
R6  10k  RESISTOR-0603  [R0603]

### Nets
N$1: C3.2 PDU1.17(BST1)
N$2: C2.1 PDU1.18(VCC) PDU1.19(PWM)
N$3: C4.2 PDU1.14(BST2)
N$4: C3.1 L1.1 PDU1.15(SW1) PDU1.16(SW1)
N$5: C7.1 R5.1
N$6: C6.1 C7.2 PDU1.2(COMP)
N$7: C4.1 L1.2 PDU1.12(SW2) PDU1.13(SW2)
N$8: C8.2 R3.2
N$9: C6.2 PDU1.3(FB) R1.1 R2.2 R3.1 R5.2
ON: PDU1.7(RUN) R6.1
REF: C1.2 C2.2 C5.2 C9.1 PDU1.1(GND) PDU1.4(OVP) PDU1.10(GND) PDU1.11(GND) PDU1.20(GND) PDU1.21(GND) R2.1 R4.1
SENS: C9.2 PDU1.8(IOUT) R4.2
VIN: C1.1 PDU1.5(VIN) PDU1.6(VIN) R6.2
VOUT: C5.1 C8.1 PDU1.9(VOUT) R1.2

### Notes on the sheet
- 1 V/A

### Library data of the parts
C1-C9 = Pasives:NONPOL_CAP
L1 = Pasives:INDUCTOR: SMD Power Inductor
PDU1 = ICs:LTC3112
R1-R6 = Pasives:RESISTOR: RESISTOR

## Module CONTROLLER
Ports: 5V_IN(pwr) 7.5V_IN(pwr) TX(io) IS_PV(io) PV_BUS(io) REF(pwr) IS_LOAD(io) IS_PDU_3.3V(io) IS_PDU_5V(io) 3.3V_PL(io) 5V_PL(io)
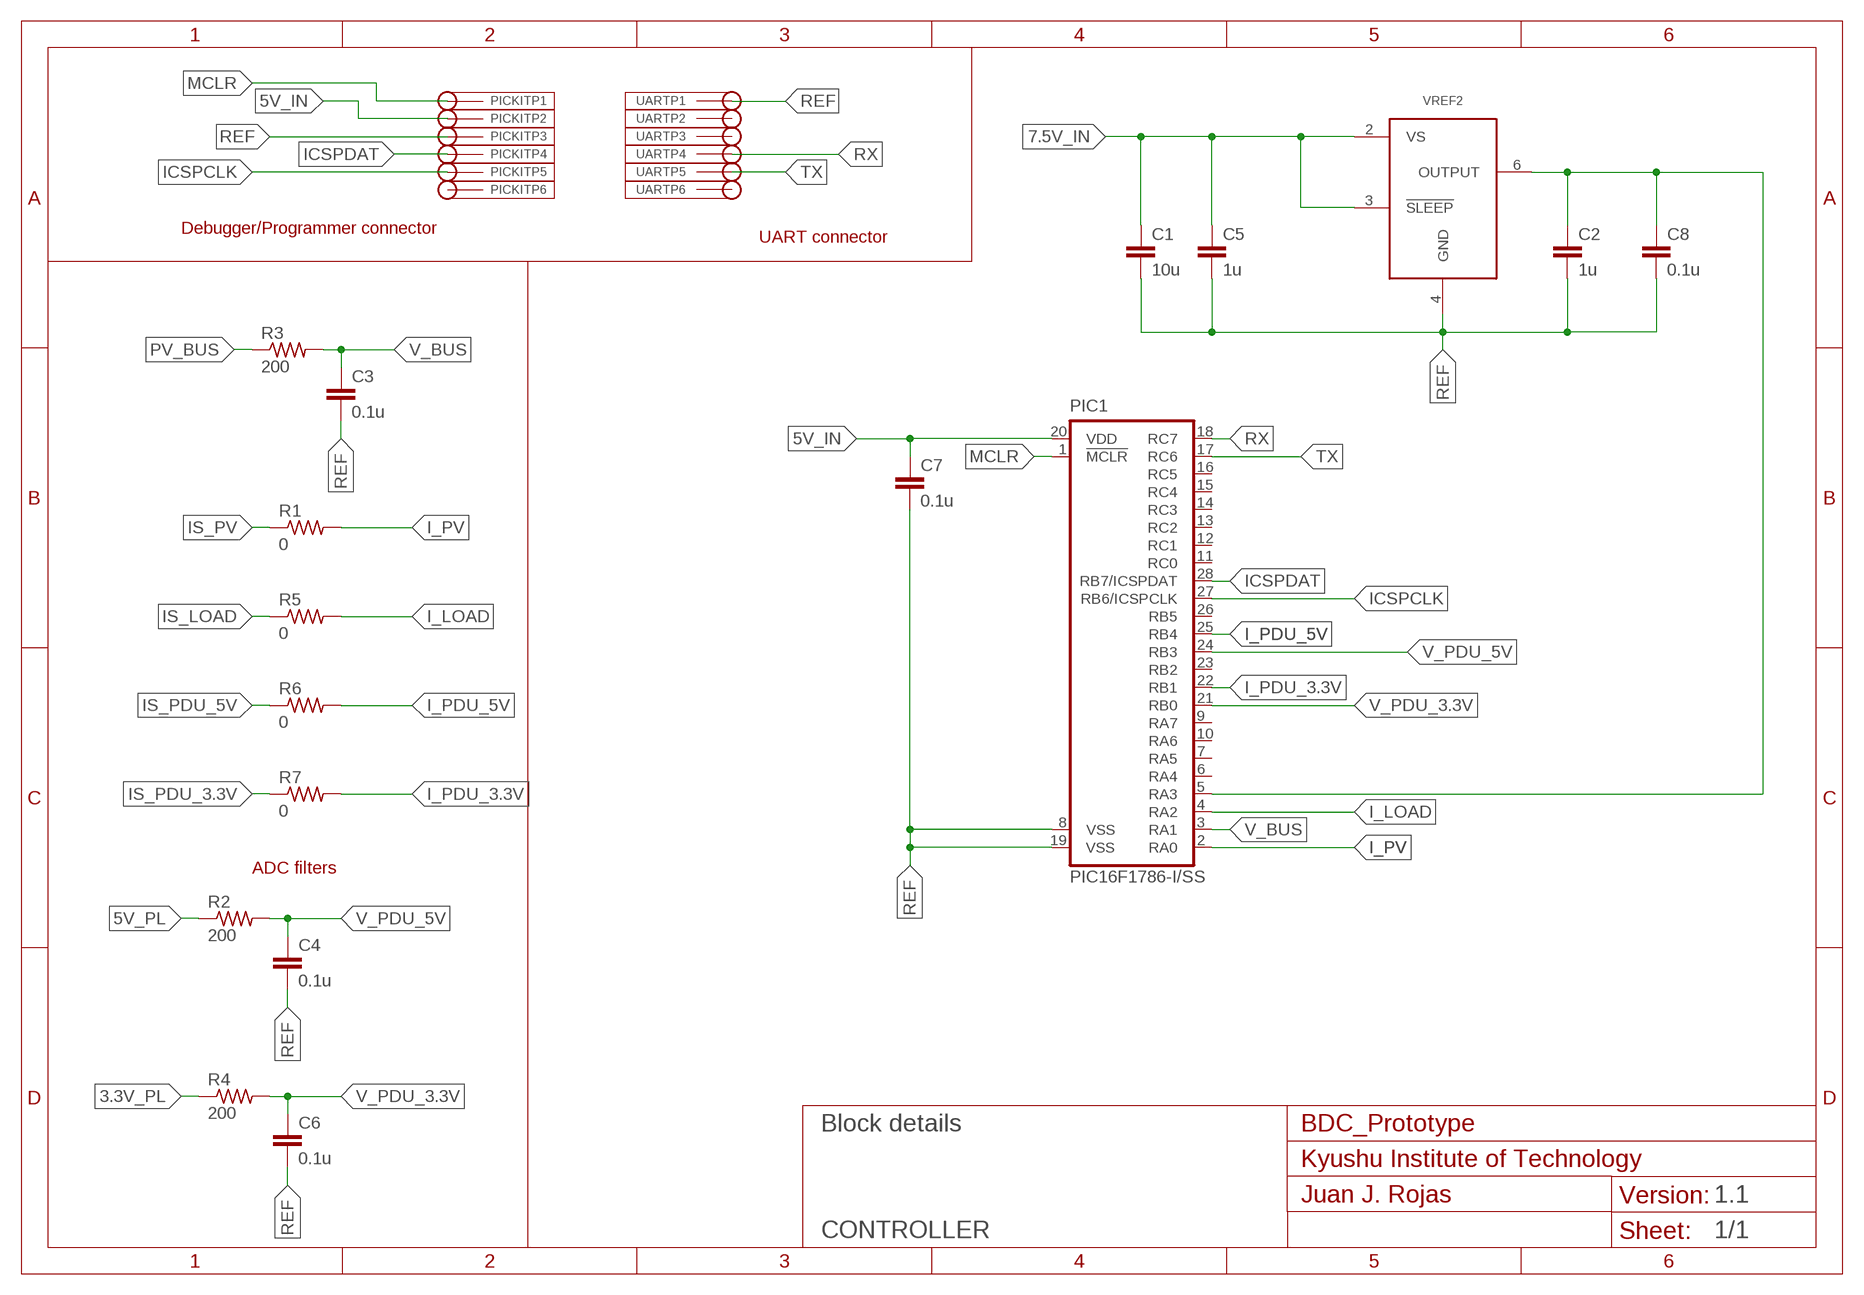
[diagram p8: schematic, module CONTROLLER, sheet 1]
FRAME2 (A4L-JUANJO): TITLE: Block details

### Parts
C1  10u  NONPOL_CAP-0603  [C0603]
C2  1u  NONPOL_CAP-0603  [C0603]
C3  0.1u  NONPOL_CAP-0603  [C0603]
C4  0.1u  NONPOL_CAP-0603  [C0603]
C5  1u  NONPOL_CAP-0603  [C0603]
C6  0.1u  NONPOL_CAP-0603  [C0603]
C7  0.1u  NONPOL_CAP-0603  [C0603]
C8  0.1u  NONPOL_CAP-0603  [C0603]
PIC1  PIC16F1786-I/SS  [SSOP28]
PICKIT  MA06-1  [MA06-1]
R1  0  RESISTOR-0603  [R0603]
R2  200  RESISTOR-0603  [R0603]
R3  200  RESISTOR-0603  [R0603]
R4  200  RESISTOR-0603  [R0603]
R5  0  RESISTOR-0603  [R0603]
R6  0  RESISTOR-0603  [R0603]
R7  0  RESISTOR-0603  [R0603]
UART  MA06-1  [MA06-1]
VREF2  REF195GSZ  [SOIC-8]

### Nets
3.3V_PL: R4.1
5V_IN: C7.1 PIC1.20(VDD) PICKIT.2
5V_PL: R2.1
5V_REF: C2.1 C8.1 PIC1.5(RA3) VREF2.6(OUTPUT)
7.5V_IN: C1.1 C5.1 VREF2.2(VS) VREF2.3(!SLEEP!)
I_LOAD: PIC1.4(RA2) R5.2
I_PDU_3.3V: PIC1.22(RB1) R7.2
I_PDU_5V: PIC1.25(RB4) R6.2
I_PV: PIC1.2(RA0) R1.2
ICSPCLK: PIC1.27(RB6/ICSPCLK) PICKIT.5
ICSPDAT: PIC1.28(RB7/ICSPDAT) PICKIT.4
IS_LOAD: R5.1
IS_PDU_3.3V: R7.1
IS_PDU_5V: R6.1
IS_PV: R1.1
MCLR: PIC1.1(!MCLR) PICKIT.1
PV_BUS: R3.1
REF: C1.2 C2.2 C3.2 C4.2 C5.2 C6.2 C7.2 C8.2 PIC1.8(VSS) PIC1.19(VSS) PICKIT.3 UART.1 VREF2.4(GND)
RX: PIC1.18(RC7) UART.4
TX: PIC1.17(RC6) UART.5
V_BUS: C3.1 PIC1.3(RA1) R3.2
V_PDU_3.3V: C6.1 PIC1.21(RB0) R4.2
V_PDU_5V: C4.1 PIC1.24(RB3) R2.2
Unconnected: PIC1.6(RA4) PIC1.7(RA5) PIC1.9(RA7) PIC1.10(RA6) PIC1.11(RC0) PIC1.12(RC1) PIC1.13(RC2) PIC1.14(RC3) PIC1.15(RC4) PIC1.16(RC5) PIC1.23(RB2) PIC1.26(RB5) PICKIT.6 UART.2 UART.3 UART.6

### Notes on the sheet
- Debugger/Programmer connector
- UART connector
- ADC filters

### Library data of the parts
C1-C8 = Pasives:NONPOL_CAP
PIC1 = ICs:PIC16F1786
PICKIT UART = Interfaces:MA06-1: PIN HEADER; OC_FARNELL: unknown; OC_NEWARK: unknown
R1-R7 = Pasives:RESISTOR: RESISTOR
VREF2 = ICs:REF195GSZ